# Altium project 28_Pins.PrjPcb (part 3 of 4)
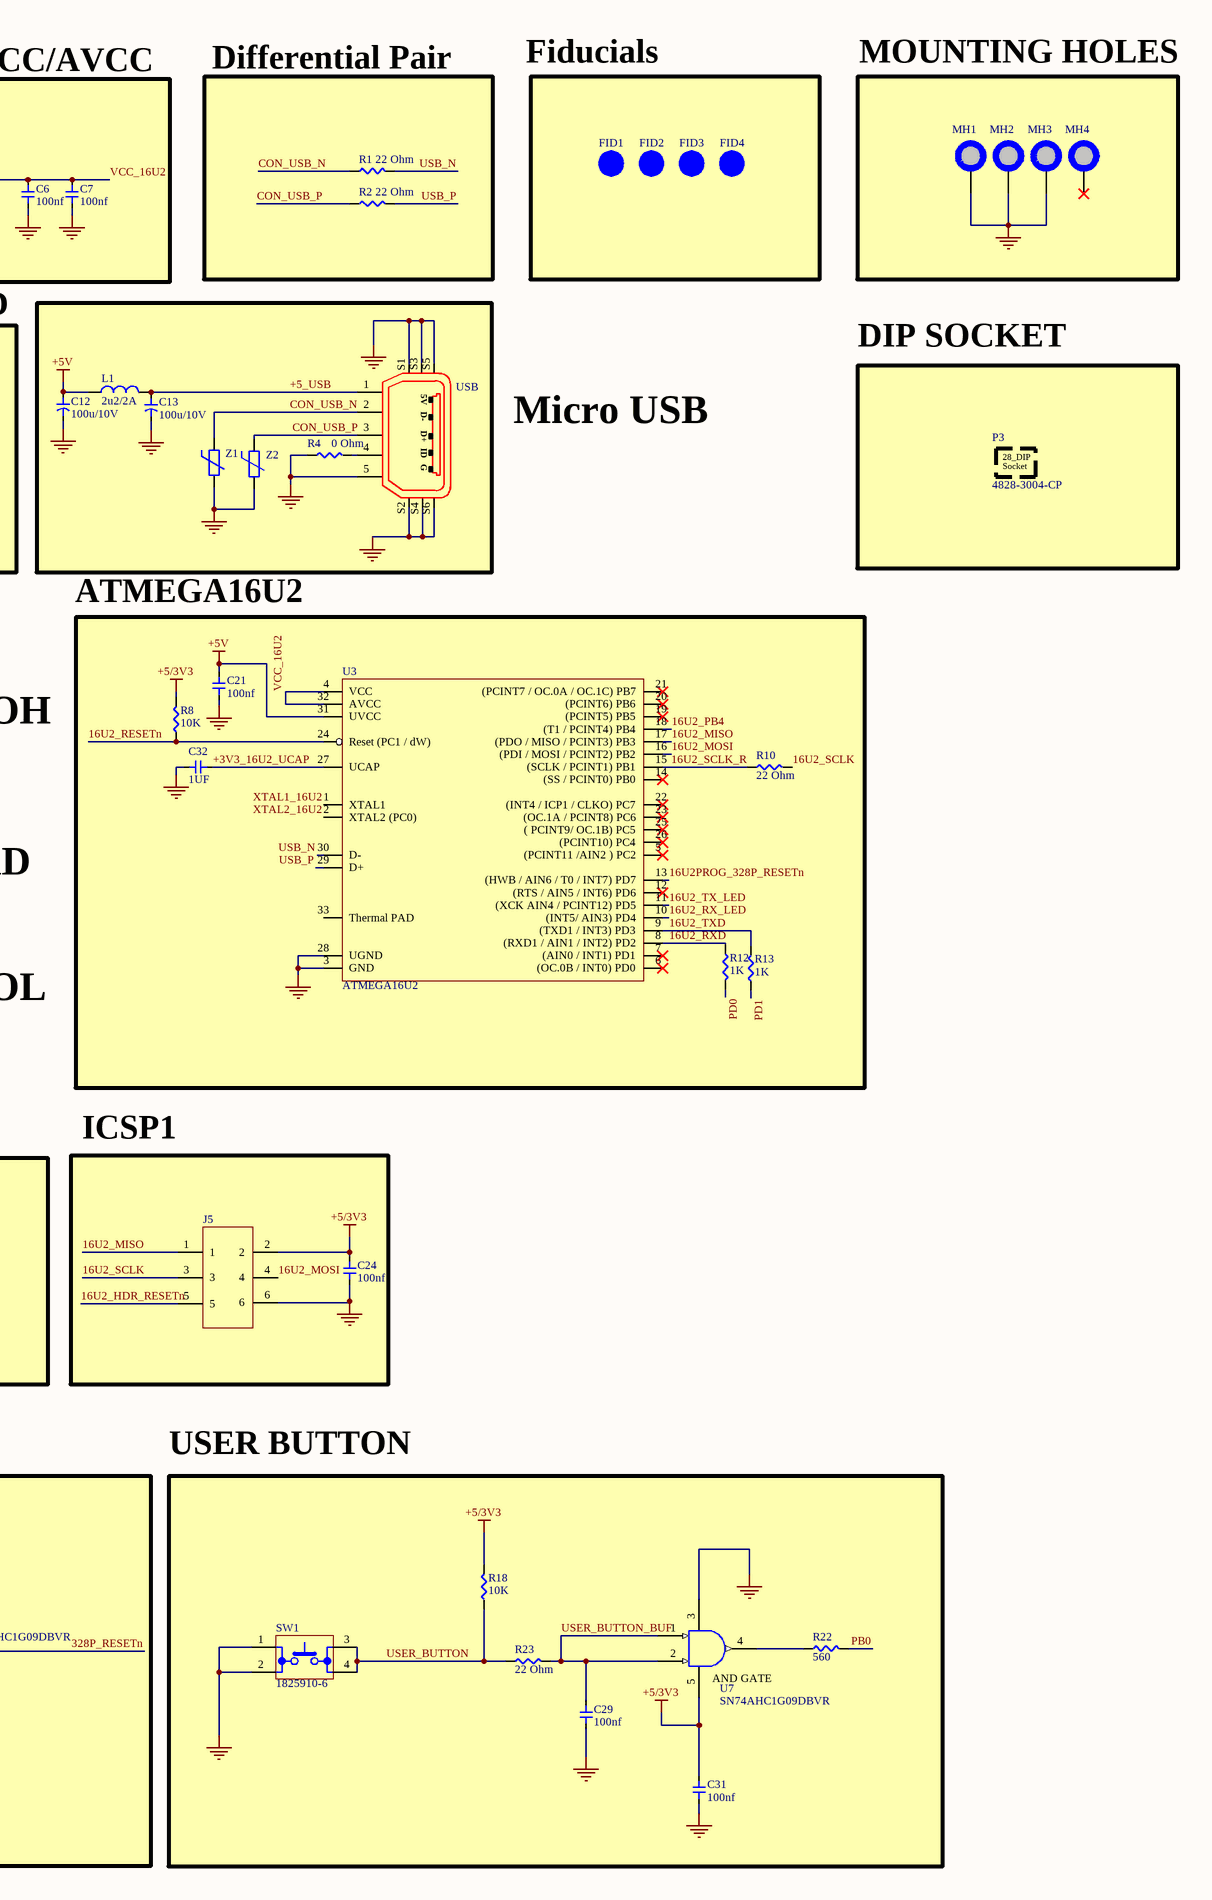
[diagram p3: 28_Pins.SchDoc, right]

## Sheet 28_Pins.SchDoc (continued)

### Library data of the parts (continued)
J5 J6 = 67997-106HLF: Conn; Rect; Header; Unshrouded; 6 Pos; 2.54mm Pitch; 2-Row; Thru-Hole; BergStik; Manufacturer: Amphenol Communications Solutions; Connector Type: Male Pin; Current Rating: 5A; Dielectric Material: Polyethylene; Gender: Male; Insulation Resistance: 5GΩ; Lead Length: 3.05mm; Mating Post Length: 5.84mm; Max Voltage Rating (AC): 1.5kV; Number of Contacts: 6; Supplier 1: DigiKey; Manufacturer Part Number: 67997-106HLF; RoHS: Compliant; Category: Headers and Wire Housings; Stock 1: 3917; Pricing 1: 1=0.58, 10=0.49, 400=0.37728, 800=0.35925, 1200=0.34911, 5200=0.31479, 10000=0.3006 (USD); China RoHS: Compliant; Color: Black; Contact Gender: Male; Contact Material: Bronze; Contact Mating Length: 5.842mm; Contact Plating: Gold; Depth: 4.83mm; Flammability Rating: UL94 V-0; Housing Color: Black; Housing Material: Thermoplastic; Lead Free: Lead Free; Lead Pitch: 2.54mm; Length: 7.62mm; Lifecycle Status: Production; Max Operating Temperature: 130°C; Min Operating Temperature: -65°C; Mount: Through Hole; Number of Pins: 6; Number of Positions: 6; Number of Rows: 2; Orientation: Straight; Pitch: 2.54mm; Radiation Hardening: No; REACH SVHC: Yes; Row Spacing: 2.54mm; Schedule B: 8535908040, 8535908040|8535908040|8535908040|8535908040|8535908040|8535908040|8535908040|8535908040|8535908040|8535908040|8535908040|8535908040|8535908040|8535908040|8535908040|8535908040|8535908040|8535908040|8535908040|8535908040|8535908040|8535908040|8535908040|85; Terminal Pitch: 2.54mm; Termination: Through Hole; Voltage Rating: 1.5kV; ComponentLink1URL: https://datasheet.octopart.com:443/67997-106HLF-Amphenol-Communications-Solutions-datasheet-10288749.pdf?src-supplier=Newark; ComponentLink1Description: https://datasheet.octopart.com:443/67997-106HLF-Amphenol-Communications-Solutions-datasheet-10288749.pdf?src-supplier=Newark; ComponentLink2URL: https://datasheet.octopart.com:443/67997-106HLF-Areva-datasheet-10052131.pdf?src-supplier=Newark; ComponentLink2Description: https://datasheet.octopart.com:443/67997-106HLF-Areva-datasheet-10052131.pdf?src-supplier=Newark; ComponentLink3URL: https://datasheet.octopart.com:443/67997-106HLF-Areva-datasheet-8877144.pdf?src-supplier=Newark; ComponentLink3Description: https://datasheet.octopart.com:443/67997-106HLF-Areva-datasheet-8877144.pdf?src-supplier=Newark; ComponentLink4URL: https://datasheet.octopart.com:443/67997-106HLF-Areva-datasheet-8731571.pdf?src-supplier=Newark; ComponentLink4Description: https://datasheet.octopart.com:443/67997-106HLF-Areva-datasheet-8731571.pdf?src-supplier=Newark; ComponentLink5URL: https://datasheet.octopart.com:443/67997-106HLF-Areva-datasheet-8486089.pdf?src-supplier=Newark; ComponentLink5Description: https://datasheet.octopart.com:443/67997-106HLF-Areva-datasheet-8486089.pdf?src-supplier=Newark; ComponentLink6URL: https://datasheet.octopart.com:443/67997-106HLF-Amphenol-Communications-Solutions-datasheet-36854132.pdf?src-supplier=Farnell; ComponentLink6Description: https://datasheet.octopart.com:443/67997-106HLF-Amphenol-Communications-Solutions-datasheet-36854132.pdf?src-supplier=Farnell; ComponentLink7URL: https://datasheet.octopart.com:443/67997-106HLF-Amphenol-Communications-Solutions-datasheet-20739478.pdf?src-supplier=RS+(Formerly+Allied+Electronics); ComponentLink7Description: https://datasheet.octopart.com:443/67997-106HLF-Amphenol-Communications-Solutions-datasheet-20739478.pdf?src-supplier=RS+(Formerly+Allied+Electronics); ComponentLink8URL: https://datasheet.octopart.com:443/67997-106HLF-Areva-datasheet-118652.pdf?src-supplier=DigiKey; ComponentLink8Description: https://datasheet.octopart.com:443/67997-106HLF-Areva-datasheet-118652.pdf?src-supplier=DigiKey; Supplier Part Number 1: 609-3393-ND
J7 J10 = 68000-103HLF: Pin Header, Board-to-Board, 2.54 mm, 1 Rows, 3 Contacts, Through Hole, FCI BergStik II 68000; Manufacturer: Amphenol Communications Solutions; Connector Type: Male Pin; Current Rating: 3A; Dielectric Material: Polyethylene; Gender: Male; Insulation Resistance: 5GΩ; Lead Length: 2.41mm; Mating Post Length: 5.84mm; Max Voltage Rating (AC): 1.5kV; Number of Contacts: 3; Pitch: 2.54mm; Plating Thickness: 762nm; Voltage Rating: 1.05kV; Supplier 1: Avnet; Manufacturer Part Number: 68000-103HLF; RoHS: Compliant; Category: Headers and Wire Housings; Stock 1: 9210; Pricing 1: 1=0.332, 2=0.298, 4=0.286, 8=0.264, 16=0.241, 32=0.238, 64=0.234 (USD); China RoHS: Compliant; Color: Black; Contact Gender: Male; Contact Material: Gold; Contact Mating Length: 5.842mm; Contact Plating: Gold; Depth: 2.41mm; Flammability Rating: UL94 V-0; Height: 8.73mm; Housing Color: Black; Housing Material: Thermoplastic; Lead Pitch: 2.54mm; Length: 7.62mm; Lifecycle Status: Production; Max Operating Temperature: 125°C; Min Operating Temperature: -65°C; Mount: Through Hole; Number of Pins: 3; Number of Positions: 3; Number of Rows: 1; Orientation: Straight; Packaging: Bulk; Radiation Hardening: No; REACH SVHC: Yes; Terminal Pitch: 2.54mm; Termination: Solder; ComponentLink1URL: https://datasheet.octopart.com:443/68000-103HLF-Amphenol-ICC---FCI-datasheet-155511504.pdf?src-supplier=Upverter; ComponentLink1Description: https://datasheet.octopart.com:443/68000-103HLF-Amphenol-ICC---FCI-datasheet-155511504.pdf?src-supplier=Upverter; ComponentLink2URL: https://datasheet.octopart.com:443/68000-103HLF-Amphenol-Communications-Solutions-datasheet-10088795.pdf?src-supplier=Farnell; ComponentLink2Description: https://datasheet.octopart.com:443/68000-103HLF-Amphenol-Communications-Solutions-datasheet-10088795.pdf?src-supplier=Farnell; ComponentLink3URL: https://datasheet.octopart.com:443/68000-103HLF-Amphenol-Communications-Solutions-datasheet-41232361.pdf?src-supplier=Farnell; ComponentLink3Description: https://datasheet.octopart.com:443/68000-103HLF-Amphenol-Communications-Solutions-datasheet-41232361.pdf?src-supplier=Farnell; ComponentLink4URL: https://datasheet.octopart.com:443/68000-103HLF-Areva-datasheet-8861575.pdf?src-supplier=Newark; ComponentLink4Description: https://datasheet.octopart.com:443/68000-103HLF-Areva-datasheet-8861575.pdf?src-supplier=Newark; ComponentLink5URL: https://datasheet.octopart.com:443/68000-103HLF-Areva-datasheet-8713716.pdf?src-supplier=Newark; ComponentLink5Description: https://datasheet.octopart.com:443/68000-103HLF-Areva-datasheet-8713716.pdf?src-supplier=Newark; ComponentLink6URL: https://datasheet.octopart.com:443/68000-103HLF-Areva-datasheet-8449737.pdf?src-supplier=Newark; ComponentLink6Description: https://datasheet.octopart.com:443/68000-103HLF-Areva-datasheet-8449737.pdf?src-supplier=Newark; ComponentLink7URL: https://datasheet.octopart.com:443/68000-103HLF-Amphenol-Communications-Solutions-datasheet-154727322.pdf?src-supplier=Electro+Sonic; ComponentLink7Description: https://datasheet.octopart.com:443/68000-103HLF-Amphenol-Communications-Solutions-datasheet-154727322.pdf?src-supplier=Electro+Sonic; ComponentLink8URL: https://datasheet.octopart.com:443/68000-103HLF-Amphenol-Communications-Solutions-datasheet-100449246.pdf?src-supplier=TME; ComponentLink8Description: https://datasheet.octopart.com:443/68000-103HLF-Amphenol-Communications-Solutions-datasheet-100449246.pdf?src-supplier=TME; ComponentLink9URL: https://datasheet.octopart.com:443/68000-103HLF-Amphenol-datasheet-170317325.pdf?src-supplier=Amar+Radio+Corporation; ComponentLink9Description: https://datasheet.octopart.com:443/68000-103HLF-Amphenol-datasheet-170317325.pdf?src-supplier=Amar+Radio+Corporation; ComponentLink10URL: https://datasheet.octopart.com:443/68000-103HLF-Amphenol-Communications-Solutions-datasheet-13448982.pdf?src-supplier=RS+(Formerly+Allied+Electronics); ComponentLink10Description: https://datasheet.octopart.com:443/68000-103HLF-Amphenol-Communications-Solutions-datasheet-13448982.pdf?src-supplier=RS+(Formerly+Allied+Electronics); Supplier Part Number 1: 88K1775
J8 = 68001-204HLF: Conn Unshrouded Header HDR 4 POS 2.54mm Solder ST Top Entry Thru-Hole BergStik® Bulk; Manufacturer: Amphenol Communications Solutions; Connector Type: Male Pin; Current Rating: 3A; Gender: Male; Insulation Resistance: 5GΩ; Lead Length: 3.05mm; Mating Post Length: 5.84mm; Number of Contacts: 4; Voltage Rating: 1.5kV; Supplier 1: Avnet; Manufacturer Part Number: 68001-204HLF; RoHS: Compliant; Category: Headers and Wire Housings; Stock 1: 10500; Pricing 1: 1000=0.08941 (USD); China RoHS: Compliant; Color: Black; Contact Gender: Male; Contact Material: Bronze; Contact Mating Length: 5.842mm; Contact Plating: GXT, Gold; Flammability Rating: UL94 V-0; Housing Material: Thermoplastic; Lead Pitch: 2.54mm; Lifecycle Status: Production; Max Operating Temperature: 130°C; Min Operating Temperature: -65°C; Mount: Through Hole; Number of Pins: 4; Number of Positions: 4; Number of Rows: 1; Orientation: Straight; Packaging: Bulk; Pitch: 2.54mm; Radiation Hardening: No; REACH SVHC: Yes; Schedule B: 8535908040; Terminal Pitch: 2.54mm; Termination: Solder; ComponentLink1URL: https://datasheet.octopart.com:443/68001-204HLF-Amphenol-Communications-Solutions-datasheet-151206381.pdf?src-supplier=IHS; ComponentLink1Description: https://datasheet.octopart.com:443/68001-204HLF-Amphenol-Communications-Solutions-datasheet-151206381.pdf?src-supplier=IHS; ComponentLink2URL: https://datasheet.octopart.com:443/68001-204HLF-Amphenol-Communications-Solutions-datasheet-154727322.pdf?src-supplier=Master+Electronics; ComponentLink2Description: https://datasheet.octopart.com:443/68001-204HLF-Amphenol-Communications-Solutions-datasheet-154727322.pdf?src-supplier=Master+Electronics; ComponentLink3URL: https://datasheet.octopart.com:443/68001-204HLF-Amphenol-Communications-Solutions-datasheet-41232361.pdf?src-supplier=element14+APAC; ComponentLink3Description: https://datasheet.octopart.com:443/68001-204HLF-Amphenol-Communications-Solutions-datasheet-41232361.pdf?src-supplier=element14+APAC; ComponentLink4URL: https://datasheet.octopart.com:443/68001-204HLF-Amphenol-Communications-Solutions-datasheet-100449246.pdf?src-supplier=Future+Electronics; ComponentLink4Description: https://datasheet.octopart.com:443/68001-204HLF-Amphenol-Communications-Solutions-datasheet-100449246.pdf?src-supplier=Future+Electronics; ComponentLink5URL: https://datasheet.octopart.com:443/68001-204HLF-Amphenol-Communications-Solutions-datasheet-20739502.pdf?src-supplier=RS+(Formerly+Allied+Electronics); ComponentLink5Description: https://datasheet.octopart.com:443/68001-204HLF-Amphenol-Communications-Solutions-datasheet-20739502.pdf?src-supplier=RS+(Formerly+Allied+Electronics); Supplier Part Number 1: 68001-204HLF
L1 = L1210R2R2MDWIT: General Purpose Inductor, 2.2uH, 20%, 1 Element, Ferrite-Core, SMD, 1210; Manufacturer: KEMET; Current Rating: 2A; DC Current: 1.13A; DC Resistance (DCR): 80mΩ; Inductance: 2.2µH; Number of Circuits: 1; Self Resonant Frequency: 190MHz; Shielding: No; Test Frequency: 100kHz; Supplier 1: Farnell; Manufacturer Part Number: L1210R2R2MDWIT; RoHS: Compliant; Category: Fixed Inductors; Pricing 1: 10=0.271, 100=0.204, 500=0.189, 1000=0.173, 2000=0.17 (GBP); Case/Package: 1210; Case Code (Imperial): 1210; Case Code (Metric): 3225; Composition: Ceramic, Wirewound; Core Material: Ferrite; Depth: 2.7mm; Height: 2.5mm; Height - Seated (Max): 2.6924mm; Inductance Tolerance: 20%; Length: 3.2004mm; Lifecycle Status: Obsolete; Max Current Rating: 1.13A; Max DC Current: 2A; Max Operating Temperature: 105°C; Military Standard: Not; Min Operating Temperature: -25°C; Mount: Surface Mount; Number of Terminals: 2; Packaging: Cut Tape; Radiation Hardening: No; REACH SVHC: Yes; Resistance: 80mΩ; Schedule B: 8504500000, 8504500000|8504500000, 8504500000|8504500000|8504500000, 8504500000|8504500000|8504500000|8504500000; Termination: SMD/SMT; Tolerance: 20%; Width: 2.5mm; ComponentLink1URL: https://datasheet.octopart.com:443/L1210R2R2MDWIT-KEMET-datasheet-179859846.pdf?src-supplier=Farnell; ComponentLink1Description: https://datasheet.octopart.com:443/L1210R2R2MDWIT-KEMET-datasheet-179859846.pdf?src-supplier=Farnell; ComponentLink2URL: https://datasheet.octopart.com:443/L1210R2R2MDWIT-Kemet-datasheet-13696102.pdf?src-supplier=Farnell; ComponentLink2Description: https://datasheet.octopart.com:443/L1210R2R2MDWIT-Kemet-datasheet-13696102.pdf?src-supplier=Farnell; ComponentLink3URL: https://datasheet.octopart.com:443/L1210R2R2MDWIT-KEMET-datasheet-170164675.pdf?src-supplier=Newark; ComponentLink3Description: https://datasheet.octopart.com:443/L1210R2R2MDWIT-KEMET-datasheet-170164675.pdf?src-supplier=Newark; ComponentLink4URL: https://datasheet.octopart.com:443/L1210R2R2MDWIT-Kemet-datasheet-153804.pdf?src-supplier=element14+APAC; ComponentLink4Description: https://datasheet.octopart.com:443/L1210R2R2MDWIT-Kemet-datasheet-153804.pdf?src-supplier=element14+APAC; ComponentLink5URL: https://datasheet.octopart.com:443/L1210R2R2MDWIT-KEMET-datasheet-86778059.pdf?src-supplier=element14+APAC; ComponentLink5Description: https://datasheet.octopart.com:443/L1210R2R2MDWIT-KEMET-datasheet-86778059.pdf?src-supplier=element14+APAC; ComponentLink6URL: https://datasheet.octopart.com:443/L1210R2R2MDWIT-KEMET-datasheet-147336235.pdf?src-supplier=Ciiva; ComponentLink6Description: https://datasheet.octopart.com:443/L1210R2R2MDWIT-KEMET-datasheet-147336235.pdf?src-supplier=Ciiva; Supplier Part Number 1: 3638976
P3 = 4828-3004-CP: IC Socket, DIP28, 28 Contact(s), 2.54mm Term Pitch, 7.62mm Row Spacing, Solder; Manufacturer: 3M; Connector Type: DIP, Socket; Current Rating: 1A; Gender: Female; Insulation Resistance: 5GΩ; Number of Contacts: 28; Supplier 1: Avnet; Manufacturer Part Number: 4828-3004-CP; RoHS: Compliant; Category: Connectors; Stock 1: 1313; Pricing 1: 1=1.09, 10=0.958, 25=0.9, 50=0.863, 100=0.827, 250=0.754, 500=0.677 (USD); China RoHS: Compliant; Contact Material: Bronze; Contact Plating: Tin; Depth: 5.08mm; Housing Material: Glass; Lead Free: Lead Free; Length: 35.43mm; Lifecycle Status: Production; Max Operating Temperature: 85°C; Min Operating Temperature: -25°C; Mount: Through Hole; Number of Pins: 28; Number of Positions: 28; Number of Rows: 2; Orientation: Straight; Pitch: 2.54mm; REACH SVHC: Yes; Row Spacing: 7.62mm; Terminal Pitch: 2.54mm; Termination: Solder; Width: 10.16mm; ComponentLink1URL: https://datasheet.octopart.com:443/4828-3004-CP-3M-datasheet-11754339.pdf?src-supplier=element14+APAC; ComponentLink1Description: https://datasheet.octopart.com:443/4828-3004-CP-3M-datasheet-11754339.pdf?src-supplier=element14+APAC; ComponentLink2URL: https://datasheet.octopart.com:443/4828-3004-CP-3M-datasheet-125432.pdf?src-supplier=Verical; ComponentLink2Description: https://datasheet.octopart.com:443/4828-3004-CP-3M-datasheet-125432.pdf?src-supplier=Verical; ComponentLink3URL: https://datasheet.octopart.com:443/4828-3004-CP-3M-datasheet-110561487.pdf?src-supplier=RS+(Formerly+Allied+Electronics); ComponentLink3Description: https://datasheet.octopart.com:443/4828-3004-CP-3M-datasheet-110561487.pdf?src-supplier=RS+(Formerly+Allied+Electronics); ComponentLink4URL: https://datasheet.octopart.com:443/4828-3004-CP-3M-datasheet-12002015.pdf?src-supplier=RS+(Formerly+Allied+Electronics); ComponentLink4Description: https://datasheet.octopart.com:443/4828-3004-CP-3M-datasheet-12002015.pdf?src-supplier=RS+(Formerly+Allied+Electronics); ComponentLink5URL: http://sigma.octopart.com:80/conflict_mineral_statement/3M-company-24.pdf?src-supplier=Compliance+Statements; ComponentLink5Description: http://sigma.octopart.com:80/conflict_mineral_statement/3M-company-24.pdf?src-supplier=Compliance+Statements; Supplier Part Number 1: 34P8056
R1 R2 R7 R10 R21 R23 R24 = RC0805FR-0722RL: Res Thick Film 0805 22 Ohm 1% 0.125W(1/8W) ±100ppm/C Pad SMD T/R; Manufacturer: Yageo Group; Max Power Dissipation: 125mW; Resistance: 22Ω; Temperature Coefficient: 100ppm/°C; Voltage Rating: 150V; Supplier 1: Future Electronics; Manufacturer Part Number: RC0805FR-0722RL; RoHS: Compliant; Category: Chip SMD Resistors; Stock 1: 385000; Pricing 1: 5000=0.0018, 25000=0.0017, 125000=0.0016, 375000=0.0016, 1000000=0.0015 (USD); Case/Package: 0805; Case Code (Imperial): 0805; China RoHS: Non-Compliant; Composition: Thick Film; Depth: 1.25mm; Features: Moisture Resistant; Height: 500µm; Lead Free: Lead Free; Length: 2.0066mm; Lifecycle Status: Production; Max Operating Temperature: 155°C; Military Standard: Not; Min Operating Temperature: -55°C; Mount: Surface Mount; Number of Pins: 2; Number of Terminals: 2; Number of Terminations: 2; Packaging: Tape & Reel; Power Dissipation: 125mW; Power Rating: 125mW; REACH SVHC: Yes; Schedule B: 8533210045, 8533210045|8533210045, 8533210045|8533210045|8533210045, 8533210045|8533210045|8533210045|8533210045; Termination: SMD/SMT; Tolerance: 1%; Voltage Rating (AC): 150V; Voltage Rating (DC): 150V; Width: 1.25mm; Working Voltage: 150V; ComponentLink1URL: https://datasheet.octopart.com:443/RC0805FR-0722RL-Yageo-datasheet-175887523.pdf?src-supplier=IHS; ComponentLink1Description: https://datasheet.octopart.com:443/RC0805FR-0722RL-Yageo-datasheet-175887523.pdf?src-supplier=IHS; ComponentLink2URL: https://datasheet.octopart.com:443/RC0805FR-0722RL-Yageo-datasheet-103092701.pdf?src-supplier=Upverter; ComponentLink2Description: https://datasheet.octopart.com:443/RC0805FR-0722RL-Yageo-datasheet-103092701.pdf?src-supplier=Upverter; ComponentLink3URL: https://datasheet.octopart.com:443/RC0805FR-0722RL-Yageo-datasheet-79472498.pdf?src-supplier=Upverter; ComponentLink3Description: https://datasheet.octopart.com:443/RC0805FR-0722RL-Yageo-datasheet-79472498.pdf?src-supplier=Upverter; ComponentLink4URL: https://datasheet.octopart.com:443/RC0805FR-0722RL-Yageo-datasheet-8330313.pdf?src-supplier=element14+APAC; ComponentLink4Description: https://datasheet.octopart.com:443/RC0805FR-0722RL-Yageo-datasheet-8330313.pdf?src-supplier=element14+APAC; ComponentLink5URL: https://datasheet.octopart.com:443/RC0805FR-0722RL-Yageo-datasheet-62067350.pdf?src-supplier=element14+APAC; ComponentLink5Description: https://datasheet.octopart.com:443/RC0805FR-0722RL-Yageo-datasheet-62067350.pdf?src-supplier=element14+APAC; ComponentLink6URL: https://datasheet.octopart.com:443/RC0805FR-0722RL-Yageo-datasheet-164759695.pdf?src-supplier=Future+Electronics; ComponentLink6Description: https://datasheet.octopart.com:443/RC0805FR-0722RL-Yageo-datasheet-164759695.pdf?src-supplier=Future+Electronics; ComponentLink7URL: https://datasheet.octopart.com:443/RC0805FR-0722RL-Yageo-datasheet-12592811.pdf?src-supplier=Future+Electronics; ComponentLink7Description: https://datasheet.octopart.com:443/RC0805FR-0722RL-Yageo-datasheet-12592811.pdf?src-supplier=Future+Electronics; ComponentLink8URL: https://datasheet.octopart.com:443/RC0805FR-0722RL-Yageo-datasheet-8324252.pdf?src-supplier=Future+Electronics; ComponentLink8Description: https://datasheet.octopart.com:443/RC0805FR-0722RL-Yageo-datasheet-8324252.pdf?src-supplier=Future+Electronics; ComponentLink9URL: https://datasheet.octopart.com/RC0805FR-0722RL-Yageo-datasheet-73766026.pdf; ComponentLink9Description: https://datasheet.octopart.com/RC0805FR-0722RL-Yageo-datasheet-73766026.pdf; ComponentLink10URL: https://datasheet.octopart.com:443/RC0805FR-0722RL-Yageo-datasheet-13691069.pdf?src-supplier=Farnell; ComponentLink10Description: https://datasheet.octopart.com:443/RC0805FR-0722RL-Yageo-datasheet-13691069.pdf?src-supplier=Farnell; ComponentLink11URL: https://datasheet.octopart.com:443/RC0805FR-0722RL-Yageo-datasheet-118657.pdf?src-supplier=DigiKey; ComponentLink11Description: https://datasheet.octopart.com:443/RC0805FR-0722RL-Yageo-datasheet-118657.pdf?src-supplier=DigiKey; ComponentLink12URL: http://sigma.octopart.com:80/rohs_statement/Yageo-company-2.pdf?src-supplier=Compliance+Statements; ComponentLink12Description: http://sigma.octopart.com:80/rohs_statement/Yageo-company-2.pdf?src-supplier=Compliance+Statements; ComponentLink13URL: http://sigma.octopart.com:80/conflict_mineral_statement/Yageo-company-3.pdf?src-supplier=Compliance+Statements; ComponentLink13Description: http://sigma.octopart.com:80/conflict_mineral_statement/Yageo-company-3.pdf?src-supplier=Compliance+Statements; Supplier Part Number 1: 3012390
R3 R8 R9 R17-R20 = RC0805FR-0710KL: Res Thick Film 0805 10K Ohm 1% 0.125W(1/8W) +/-100ppm/C Epoxy Pad SMD T/R; Manufacturer: Yageo Group; Max Power Dissipation: 125mW; Resistance: 10kΩ; Temperature Coefficient: 100ppm/°C; Voltage Rating: 150V; Supplier 1: Future Electronics; Manufacturer Part Number: RC0805FR-0710KL; RoHS: Compliant; Category: Chip SMD Resistors; Stock 1: 5075000; Pricing 1: 5000=0.0018, 25000=0.0017, 125000=0.0016, 375000=0.0016, 1000000=0.0015 (USD); Case/Package: 0805; Case Code (Imperial): 0805; China RoHS: Non-Compliant; Composition: Thick Film; Depth: 1.25mm; Features: Moisture Resistant; Height: 500µm; Lead Free: Lead Free; Length: 2mm; Lifecycle Status: Production; Max Operating Temperature: 155°C; Military Standard: Not; Min Operating Temperature: -55°C; Mount: Surface Mount; Number of Pins: 2; Number of Terminals: 2; Number of Terminations: 2; Packaging: Tape and Reel; Power Dissipation: 125mW; Power Rating: 125mW; REACH SVHC: Yes; Schedule B: 8533210045, 8533210045|8533210045|8533210045|8533210045|8533210045|8533210045|8533210045|8533210045|8533210045|8533210045|8533210045|8533210045|8533210045|8533210045|8533210045|8533210045|8533210045|8533210045|8533210045|8533210045|8533210045|8533210045|8533210045|85; Termination: SMD/SMT; Tolerance: 1%; Voltage Rating (AC): 150V; Width: 1.25mm; Working Voltage: 150V; ComponentLink1URL: https://datasheet.octopart.com:443/RC0805FR-0710KL-Yageo-datasheet-175887523.pdf?src-supplier=IHS; ComponentLink1Description: https://datasheet.octopart.com:443/RC0805FR-0710KL-Yageo-datasheet-175887523.pdf?src-supplier=IHS; ComponentLink2URL: https://datasheet.octopart.com:443/RC0805FR-0710KL-Yageo-datasheet-62067350.pdf?src-supplier=Farnell; ComponentLink2Description: https://datasheet.octopart.com:443/RC0805FR-0710KL-Yageo-datasheet-62067350.pdf?src-supplier=Farnell; ComponentLink3URL: https://datasheet.octopart.com:443/RC0805FR-0710KL-Yageo-datasheet-13691069.pdf?src-supplier=Farnell; ComponentLink3Description: https://datasheet.octopart.com:443/RC0805FR-0710KL-Yageo-datasheet-13691069.pdf?src-supplier=Farnell; ComponentLink4URL: https://datasheet.octopart.com:443/RC0805FR-0710KL-Yageo-datasheet-103092701.pdf?src-supplier=Upverter; ComponentLink4Description: https://datasheet.octopart.com:443/RC0805FR-0710KL-Yageo-datasheet-103092701.pdf?src-supplier=Upverter; ComponentLink5URL: https://datasheet.octopart.com:443/RC0805FR-0710KL-Yageo-datasheet-98239111.pdf?src-supplier=Upverter; ComponentLink5Description: https://datasheet.octopart.com:443/RC0805FR-0710KL-Yageo-datasheet-98239111.pdf?src-supplier=Upverter; ComponentLink6URL: https://datasheet.octopart.com:443/RC0805FR-0710KL-Yageo---Phycomp-datasheet-67302840.pdf?src-supplier=Upverter; ComponentLink6Description: https://datasheet.octopart.com:443/RC0805FR-0710KL-Yageo---Phycomp-datasheet-67302840.pdf?src-supplier=Upverter; ComponentLink7URL: https://datasheet.octopart.com:443/RC0805FR-0710KL-Yageo-datasheet-8330313.pdf?src-supplier=element14+APAC; ComponentLink7Description: https://datasheet.octopart.com:443/RC0805FR-0710KL-Yageo-datasheet-8330313.pdf?src-supplier=element14+APAC; ComponentLink8URL: https://datasheet.octopart.com:443/RC0805FR-0710KL-Yageo-datasheet-12592811.pdf?src-supplier=element14+APAC; ComponentLink8Description: https://datasheet.octopart.com:443/RC0805FR-0710KL-Yageo-datasheet-12592811.pdf?src-supplier=element14+APAC; ComponentLink9URL: https://datasheet.octopart.com:443/RC0805FR-0710KL-Yageo-datasheet-164759695.pdf?src-supplier=Future+Electronics; ComponentLink9Description: https://datasheet.octopart.com:443/RC0805FR-0710KL-Yageo-datasheet-164759695.pdf?src-supplier=Future+Electronics; ComponentLink10URL: https://datasheet.octopart.com:443/RC0805FR-0710KL-Yageo-datasheet-15800360.pdf?src-supplier=Future+Electronics; ComponentLink10Description: https://datasheet.octopart.com:443/RC0805FR-0710KL-Yageo-datasheet-15800360.pdf?src-supplier=Future+Electronics; ComponentLink11URL: https://datasheet.octopart.com:443/RC0805FR-0710KL-Yageo-datasheet-8324252.pdf?src-supplier=Future+Electronics; ComponentLink11Description: https://datasheet.octopart.com:443/RC0805FR-0710KL-Yageo-datasheet-8324252.pdf?src-supplier=Future+Electronics; ComponentLink12URL: https://datasheet.octopart.com:443/RC0805FR-0710KL-Yageo-datasheet-79472498.pdf?src-supplier=Megastar; ComponentLink12Description: https://datasheet.octopart.com:443/RC0805FR-0710KL-Yageo-datasheet-79472498.pdf?src-supplier=Megastar; ComponentLink13URL: https://datasheet.octopart.com:443/RC0805FR-0710KL-Yageo-datasheet-27714392.pdf?src-supplier=Seeed+Studio; ComponentLink13Description: https://datasheet.octopart.com:443/RC0805FR-0710KL-Yageo-datasheet-27714392.pdf?src-supplier=Seeed+Studio; ComponentLink14URL: https://datasheet.octopart.com/RC0805FR-0710KL-Yageo-datasheet-73766026.pdf; ComponentLink14Description: https://datasheet.octopart.com/RC0805FR-0710KL-Yageo-datasheet-73766026.pdf; ComponentLink15URL: https://datasheet.octopart.com:443/RC0805FR-0710KL-Yageo-datasheet-118657.pdf?src-supplier=DigiKey; ComponentLink15Description: https://datasheet.octopart.com:443/RC0805FR-0710KL-Yageo-datasheet-118657.pdf?src-supplier=DigiKey; ComponentLink16URL: https://datasheet.octopart.com:443/RC0805FR-0710KL-Yageo-datasheet-502840.pdf?src-supplier=element14; ComponentLink16Description: https://datasheet.octopart.com:443/RC0805FR-0710KL-Yageo-datasheet-502840.pdf?src-supplier=element14; ComponentLink17URL: http://sigma.octopart.com:80/rohs_statement/Yageo-company-2.pdf?src-supplier=Compliance+Statements; ComponentLink17Description: http://sigma.octopart.com:80/rohs_statement/Yageo-company-2.pdf?src-supplier=Compliance+Statements; ComponentLink18URL: http://sigma.octopart.com:80/conflict_mineral_statement/Yageo-company-3.pdf?src-supplier=Compliance+Statements; ComponentLink18Description: http://sigma.octopart.com:80/conflict_mineral_statement/Yageo-company-3.pdf?src-supplier=Compliance+Statements; Supplier Part Number 1: 3310877
R4 = RC0805JR-070RL: GENERAL PURPOSE CHIP RESISTOR Metal Glaze/thick Film, 0.125W, 0ohm, Surface Mount, 0805; Manufacturer: Yageo Group; Power Dissipation: 125mW; Resistance: 0Ω; Temperature Coefficient: 300ppm/°C; Tolerance: 5%; Voltage Rating: 150V; Supplier 1: Future Electronics; Manufacturer Part Number: RC0805JR-070RL; RoHS: Compliant; Category: Chip SMD Resistors; Stock 1: 900000; Pricing 1: 5000=0.0015, 25000=0.0015, 125000=0.0014, 375000=0.0013, 1000000=0.0013 (USD); Case/Package: 0805; Case Code (Imperial): 0805; China RoHS: Non-Compliant; Composition: Thick Film; Contact Plating: Tin; Depth: 1.25mm; Height: 500µm; Lead Free: Lead Free; Length: 2mm; Lifecycle Status: Production; Max Operating Temperature: 155°C; Military Standard: Not; Min Operating Temperature: -55°C; Mount: Surface Mount; Number of Pins: 2; Number of Terminals: 2; Packaging: Tape & Reel; Power Rating: 125mW; Radiation Hardening: No; REACH SVHC: Yes; Schedule B: 8533290000, 8533290000|8533290000, 8533290000|8533290000|8533290000, 8533290000|8533290000|8533290000|8533290000; Termination: SMD/SMT; Voltage Rating (DC): 150V; Width: 1.25mm; ComponentLink1URL: https://datasheet.octopart.com:443/RC0805JR-070RL-Yageo-datasheet-182189538.pdf?src-supplier=IHS; ComponentLink1Description: https://datasheet.octopart.com:443/RC0805JR-070RL-Yageo-datasheet-182189538.pdf?src-supplier=IHS; ComponentLink2URL: https://datasheet.octopart.com:443/RC0805JR-070RL-Yageo-datasheet-103092701.pdf?src-supplier=Upverter; ComponentLink2Description: https://datasheet.octopart.com:443/RC0805JR-070RL-Yageo-datasheet-103092701.pdf?src-supplier=Upverter; ComponentLink3URL: https://datasheet.octopart.com:443/RC0805JR-070RL-Yageo-datasheet-98239111.pdf?src-supplier=Upverter; ComponentLink3Description: https://datasheet.octopart.com:443/RC0805JR-070RL-Yageo-datasheet-98239111.pdf?src-supplier=Upverter; ComponentLink4URL: https://datasheet.octopart.com:443/RC0805JR-070RL-Yageo-datasheet-8330313.pdf?src-supplier=Newark; ComponentLink4Description: https://datasheet.octopart.com:443/RC0805JR-070RL-Yageo-datasheet-8330313.pdf?src-supplier=Newark; ComponentLink5URL: https://datasheet.octopart.com:443/RC0805JR-070RL-Yageo-datasheet-8327506.pdf?src-supplier=Newark; ComponentLink5Description: https://datasheet.octopart.com:443/RC0805JR-070RL-Yageo-datasheet-8327506.pdf?src-supplier=Newark; ComponentLink6URL: https://datasheet.octopart.com:443/RC0805JR-070RL-Yageo-datasheet-62067350.pdf?src-supplier=element14+APAC; ComponentLink6Description: https://datasheet.octopart.com:443/RC0805JR-070RL-Yageo-datasheet-62067350.pdf?src-supplier=element14+APAC; ComponentLink7URL: https://datasheet.octopart.com:443/RC0805JR-070RL-Yageo-datasheet-17879891.pdf?src-supplier=element14+APAC; ComponentLink7Description: https://datasheet.octopart.com:443/RC0805JR-070RL-Yageo-datasheet-17879891.pdf?src-supplier=element14+APAC; ComponentLink8URL: https://datasheet.octopart.com:443/RC0805JR-070RL-Yageo-datasheet-164759695.pdf?src-supplier=Future+Electronics; ComponentLink8Description: https://datasheet.octopart.com:443/RC0805JR-070RL-Yageo-datasheet-164759695.pdf?src-supplier=Future+Electronics; ComponentLink9URL: https://datasheet.octopart.com:443/RC0805JR-070RL-Yageo-datasheet-15800360.pdf?src-supplier=Future+Electronics; ComponentLink9Description: https://datasheet.octopart.com:443/RC0805JR-070RL-Yageo-datasheet-15800360.pdf?src-supplier=Future+Electronics; ComponentLink10URL: https://datasheet.octopart.com:443/RC0805JR-070RL-Yageo-datasheet-12592811.pdf?src-supplier=Future+Electronics; ComponentLink10Description: https://datasheet.octopart.com:443/RC0805JR-070RL-Yageo-datasheet-12592811.pdf?src-supplier=Future+Electronics; ComponentLink11URL: https://datasheet.octopart.com:443/RC0805JR-070RL-Yageo-datasheet-8324252.pdf?src-supplier=Future+Electronics; ComponentLink11Description: https://datasheet.octopart.com:443/RC0805JR-070RL-Yageo-datasheet-8324252.pdf?src-supplier=Future+Electronics; ComponentLink12URL: https://datasheet.octopart.com:443/RC0805JR-070RL-Yageo-datasheet-79472498.pdf?src-supplier=Megastar; ComponentLink12Description: https://datasheet.octopart.com:443/RC0805JR-070RL-Yageo-datasheet-79472498.pdf?src-supplier=Megastar; ComponentLink13URL: https://datasheet.octopart.com/RC0805JR-070RL-Yageo-datasheet-73766026.pdf; ComponentLink13Description: https://datasheet.octopart.com/RC0805JR-070RL-Yageo-datasheet-73766026.pdf; ComponentLink14URL: https://datasheet.octopart.com:443/RC0805JR-070RL-Yageo-datasheet-8377918.pdf?src-supplier=Farnell; ComponentLink14Description: https://datasheet.octopart.com:443/RC0805JR-070RL-Yageo-datasheet-8377918.pdf?src-supplier=Farnell; ComponentLink15URL: https://datasheet.octopart.com:443/RC0805JR-070RL-Yageo-datasheet-118657.pdf?src-supplier=DigiKey; ComponentLink15Description: https://datasheet.octopart.com:443/RC0805JR-070RL-Yageo-datasheet-118657.pdf?src-supplier=DigiKey; ComponentLink16URL: http://sigma.octopart.com:80/rohs_statement/Yageo-company-2.pdf?src-supplier=Compliance+Statements; ComponentLink16Description: http://sigma.octopart.com:80/rohs_statement/Yageo-company-2.pdf?src-supplier=Compliance+Statements; ComponentLink17URL: http://sigma.octopart.com:80/conflict_mineral_statement/Yageo-company-3.pdf?src-supplier=Compliance+Statements; ComponentLink17Description: http://sigma.octopart.com:80/conflict_mineral_statement/Yageo-company-3.pdf?src-supplier=Compliance+Statements; Supplier Part Number 1: 2506467
R5 R6 = RC0805FR-071ML: 125Mw Thick Film Resistors 100Ppm/ 1% 1M 0805 Chip Resistor Surface Mount Rohs; Manufacturer: Yageo Group; Resistance: 1MΩ; Temperature Coefficient: 100ppm/°C; Voltage Rating: 150V; Supplier 1: Avnet; Manufacturer Part Number: RC0805FR-071ML; RoHS: Compliant; Category: Chip SMD Resistors; Stock 1: 95000; Pricing 1: 5000=0.00245, 10000=0.00244, 20000=0.00243, 40000=0.00241, 80000=0.0024 (USD); Case/Package: 0805; Case Code (Imperial): 0805; China RoHS: Non-Compliant; Composition: Thick Film; Depth: 1.25mm; Features: Moisture Resistant; Height: 500µm; Lead Free: Lead Free; Length: 2mm; Lifecycle Status: Production; Max Operating Temperature: 155°C; Max Power Dissipation: 125mW; Military Standard: Not; Min Operating Temperature: -55°C; Mount: Surface Mount; Number of Pins: 2; Number of Terminals: 2; Number of Terminations: 2; Packaging: Tape & Reel; Power Dissipation: 125mW; Power Rating: 125mW; REACH SVHC: Yes; Schedule B: 8533210045, 8533210045|8533210045, 8533210045|8533210045|8533210045, 8533210045|8533210045|8533210045|8533210045; Termination: SMD/SMT; Tolerance: 1%; Voltage Rating (AC): 150V; Voltage Rating (DC): 150V; Width: 1.25mm; Working Voltage: 150V; ComponentLink1URL: https://datasheet.octopart.com:443/RC0805FR-071ML-Yageo-datasheet-175887523.pdf?src-supplier=IHS; ComponentLink1Description: https://datasheet.octopart.com:443/RC0805FR-071ML-Yageo-datasheet-175887523.pdf?src-supplier=IHS; ComponentLink2URL: https://datasheet.octopart.com:443/RC0805FR-071ML-Yageo-datasheet-103092701.pdf?src-supplier=Upverter; ComponentLink2Description: https://datasheet.octopart.com:443/RC0805FR-071ML-Yageo-datasheet-103092701.pdf?src-supplier=Upverter; ComponentLink3URL: https://datasheet.octopart.com:443/RC0805FR-071ML-Yageo-datasheet-79472498.pdf?src-supplier=Upverter; ComponentLink3Description: https://datasheet.octopart.com:443/RC0805FR-071ML-Yageo-datasheet-79472498.pdf?src-supplier=Upverter; ComponentLink4URL: https://datasheet.octopart.com:443/RC0805FR-071ML-Yageo-datasheet-8330313.pdf?src-supplier=element14+APAC; ComponentLink4Description: https://datasheet.octopart.com:443/RC0805FR-071ML-Yageo-datasheet-8330313.pdf?src-supplier=element14+APAC; ComponentLink5URL: https://datasheet.octopart.com:443/RC0805FR-071ML-Yageo-datasheet-62067350.pdf?src-supplier=Farnell; ComponentLink5Description: https://datasheet.octopart.com:443/RC0805FR-071ML-Yageo-datasheet-62067350.pdf?src-supplier=Farnell; ComponentLink6URL: https://datasheet.octopart.com:443/RC0805FR-071ML-Yageo-datasheet-13691069.pdf?src-supplier=Farnell; ComponentLink6Description: https://datasheet.octopart.com:443/RC0805FR-071ML-Yageo-datasheet-13691069.pdf?src-supplier=Farnell; ComponentLink7URL: https://datasheet.octopart.com:443/RC0805FR-071ML-Yageo-datasheet-164759695.pdf?src-supplier=Future+Electronics; ComponentLink7Description: https://datasheet.octopart.com:443/RC0805FR-071ML-Yageo-datasheet-164759695.pdf?src-supplier=Future+Electronics; ComponentLink8URL: https://datasheet.octopart.com:443/RC0805FR-071ML-Yageo-datasheet-127823281.pdf?src-supplier=Future+Electronics; ComponentLink8Description: https://datasheet.octopart.com:443/RC0805FR-071ML-Yageo-datasheet-127823281.pdf?src-supplier=Future+Electronics; ComponentLink9URL: https://datasheet.octopart.com:443/RC0805FR-071ML-Yageo-datasheet-137700087.pdf?src-supplier=Future+Electronics; ComponentLink9Description: https://datasheet.octopart.com:443/RC0805FR-071ML-Yageo-datasheet-137700087.pdf?src-supplier=Future+Electronics; ComponentLink10URL: https://datasheet.octopart.com:443/RC0805FR-071ML-Yageo-datasheet-12592811.pdf?src-supplier=Future+Electronics; ComponentLink10Description: https://datasheet.octopart.com:443/RC0805FR-071ML-Yageo-datasheet-12592811.pdf?src-supplier=Future+Electronics; ComponentLink11URL: https://datasheet.octopart.com:443/RC0805FR-071ML-Yageo-datasheet-8324252.pdf?src-supplier=Future+Electronics; ComponentLink11Description: https://datasheet.octopart.com:443/RC0805FR-071ML-Yageo-datasheet-8324252.pdf?src-supplier=Future+Electronics; ComponentLink12URL: https://datasheet.octopart.com/RC0805FR-071ML-Yageo-datasheet-73766026.pdf; ComponentLink12Description: https://datasheet.octopart.com/RC0805FR-071ML-Yageo-datasheet-73766026.pdf; ComponentLink13URL: https://datasheet.octopart.com:443/RC0805FR-071ML-Yageo-datasheet-118657.pdf?src-supplier=DigiKey; ComponentLink13Description: https://datasheet.octopart.com:443/RC0805FR-071ML-Yageo-datasheet-118657.pdf?src-supplier=DigiKey; ComponentLink14URL: https://datasheet.octopart.com:443/RC0805FR-071ML-Yageo-datasheet-502840.pdf?src-supplier=element14; ComponentLink14Description: https://datasheet.octopart.com:443/RC0805FR-071ML-Yageo-datasheet-502840.pdf?src-supplier=element14; ComponentLink15URL: http://sigma.octopart.com:80/rohs_statement/Yageo-company-2.pdf?src-supplier=Compliance+Statements; ComponentLink15Description: http://sigma.octopart.com:80/rohs_statement/Yageo-company-2.pdf?src-supplier=Compliance+Statements; ComponentLink16URL: http://sigma.octopart.com:80/conflict_mineral_statement/Yageo-company-3.pdf?src-supplier=Compliance+Statements; ComponentLink16Description: http://sigma.octopart.com:80/conflict_mineral_statement/Yageo-company-3.pdf?src-supplier=Compliance+Statements; Supplier Part Number 1: RC0805FR-071ML
R11 R14 R22 = RC0805FR-07560RL: Res Thick Film 0805 560 Ohm 1% 0.125W(1/8W) ±100ppm/C Pad SMD T/R; Manufacturer: Yageo Group; Max Power Dissipation: 125mW; Resistance: 560Ω; Temperature Coefficient: 100ppm/°C; Voltage Rating: 150V; Supplier 1: Future Electronics; Manufacturer Part Number: RC0805FR-07560RL; RoHS: Compliant; Category: Chip SMD Resistors; Stock 1: 90000; Pricing 1: 5000=0.0018, 25000=0.0017, 125000=0.0016, 375000=0.0016, 1000000=0.0015 (USD); Case/Package: 0805; Case Code (Imperial): 0805; China RoHS: Non-Compliant; Composition: Thick Film; Depth: 1.25mm; Features: Moisture Resistant; Height: 500µm; Lead Free: Lead Free; Length: 2mm; Lifecycle Status: Production; Max Operating Temperature: 155°C; Military Standard: Not; Min Operating Temperature: -55°C; Mount: Surface Mount; Number of Pins: 2; Number of Terminals: 2; Number of Terminations: 2; Packaging: Tape & Reel; Power Dissipation: 125mW; Power Rating: 125mW; REACH SVHC: Yes; Schedule B: 8533210045, 8533210045|8533210045, 8533210045|8533210045|8533210045, 8533210045|8533210045|8533210045|8533210045; Termination: SMD/SMT; Tolerance: 1%; Voltage Rating (AC): 150V; Voltage Rating (DC): 150V; Weight: 5.499807mg; Width: 1.25mm; Working Voltage: 150V; ComponentLink1URL: https://datasheet.octopart.com:443/RC0805FR-07560RL-Yageo-datasheet-175887523.pdf?src-supplier=Newark; ComponentLink1Description: https://datasheet.octopart.com:443/RC0805FR-07560RL-Yageo-datasheet-175887523.pdf?src-supplier=Newark; ComponentLink2URL: https://datasheet.octopart.com:443/RC0805FR-07560RL-Yageo-datasheet-8328172.pdf?src-supplier=Newark; ComponentLink2Description: https://datasheet.octopart.com:443/RC0805FR-07560RL-Yageo-datasheet-8328172.pdf?src-supplier=Newark; ComponentLink3URL: https://datasheet.octopart.com:443/RC0805FR-07560RL-Yageo-datasheet-103092701.pdf?src-supplier=Upverter; ComponentLink3Description: https://datasheet.octopart.com:443/RC0805FR-07560RL-Yageo-datasheet-103092701.pdf?src-supplier=Upverter; ComponentLink4URL: https://datasheet.octopart.com:443/RC0805FR-07560RL-Yageo-datasheet-8330313.pdf?src-supplier=element14+APAC; ComponentLink4Description: https://datasheet.octopart.com:443/RC0805FR-07560RL-Yageo-datasheet-8330313.pdf?src-supplier=element14+APAC; ComponentLink5URL: https://datasheet.octopart.com:443/RC0805FR-07560RL-Yageo-datasheet-62067350.pdf?src-supplier=element14+APAC; ComponentLink5Description: https://datasheet.octopart.com:443/RC0805FR-07560RL-Yageo-datasheet-62067350.pdf?src-supplier=element14+APAC; ComponentLink6URL: https://datasheet.octopart.com:443/RC0805FR-07560RL-Yageo-datasheet-164759695.pdf?src-supplier=Future+Electronics; ComponentLink6Description: https://datasheet.octopart.com:443/RC0805FR-07560RL-Yageo-datasheet-164759695.pdf?src-supplier=Future+Electronics; ComponentLink7URL: https://datasheet.octopart.com:443/RC0805FR-07560RL-Yageo-datasheet-12592811.pdf?src-supplier=Future+Electronics; ComponentLink7Description: https://datasheet.octopart.com:443/RC0805FR-07560RL-Yageo-datasheet-12592811.pdf?src-supplier=Future+Electronics; ComponentLink8URL: https://datasheet.octopart.com:443/RC0805FR-07560RL-Yageo-datasheet-8324252.pdf?src-supplier=Future+Electronics; ComponentLink8Description: https://datasheet.octopart.com:443/RC0805FR-07560RL-Yageo-datasheet-8324252.pdf?src-supplier=Future+Electronics; ComponentLink9URL: https://datasheet.octopart.com:443/RC0805FR-07560RL-Yageo-datasheet-79472498.pdf?src-supplier=Megastar; ComponentLink9Description: https://datasheet.octopart.com:443/RC0805FR-07560RL-Yageo-datasheet-79472498.pdf?src-supplier=Megastar; ComponentLink10URL: https://datasheet.octopart.com/RC0805FR-07560RL-Yageo-datasheet-73766026.pdf; ComponentLink10Description: https://datasheet.octopart.com/RC0805FR-07560RL-Yageo-datasheet-73766026.pdf; ComponentLink11URL: https://datasheet.octopart.com:443/RC0805FR-07560RL-Yageo-datasheet-118657.pdf?src-supplier=DigiKey; ComponentLink11Description: https://datasheet.octopart.com:443/RC0805FR-07560RL-Yageo-datasheet-118657.pdf?src-supplier=DigiKey; ComponentLink12URL: http://sigma.octopart.com:80/rohs_statement/Yageo-company-2.pdf?src-supplier=Compliance+Statements; ComponentLink12Description: http://sigma.octopart.com:80/rohs_statement/Yageo-company-2.pdf?src-supplier=Compliance+Statements; ComponentLink13URL: http://sigma.octopart.com:80/conflict_mineral_statement/Yageo-company-3.pdf?src-supplier=Compliance+Statements; ComponentLink13Description: http://sigma.octopart.com:80/conflict_mineral_statement/Yageo-company-3.pdf?src-supplier=Compliance+Statements; Supplier Part Number 1: 2521029
R12 R13 R16 = RC0805FR-071KL: 125Mw Thick Film Resistors 100Ppm/ 1% 1K 0805 Chip Resistor Surface Mount Rohs; Manufacturer: Yageo Group; Resistance: 1kΩ; Temperature Coefficient: 100ppm/°C; Voltage Rating: 150V; Supplier 1: Future Electronics; Manufacturer Part Number: RC0805FR-071KL; RoHS: Compliant; Category: Chip SMD Resistors; Stock 1: 4230000; Pricing 1: 5000=0.0018, 25000=0.0017, 125000=0.0016, 375000=0.0016, 1000000=0.0015 (USD); Case/Package: 0805; Case Code (Imperial): 0805; China RoHS: Non-Compliant; Composition: Thick Film; Depth: 1.25mm; Features: Moisture Resistant; Height: 500µm; Lead Free: Lead Free; Length: 2mm; Lifecycle Status: Production; Max Operating Temperature: 155°C; Max Power Dissipation: 125mW; Military Standard: Not; Min Operating Temperature: -55°C; Mount: Surface Mount; Number of Pins: 2; Number of Terminals: 2; Number of Terminations: 2; Packaging: Tape & Reel; Power Dissipation: 125mW; Power Rating: 125mW; REACH SVHC: Yes; Schedule B: 8533210045, 8533210045|8533210045, 8533210045|8533210045|8533210045, 8533210045|8533210045|8533210045|8533210045; Termination: SMD/SMT; Tolerance: 1%; Voltage Rating (AC): 150V; Voltage Rating (DC): 150V; Width: 1.25mm; Working Voltage: 150V; ComponentLink1URL: https://datasheet.octopart.com:443/RC0805FR-071KL-Yageo-datasheet-175887523.pdf?src-supplier=IHS; ComponentLink1Description: https://datasheet.octopart.com:443/RC0805FR-071KL-Yageo-datasheet-175887523.pdf?src-supplier=IHS; ComponentLink2URL: https://datasheet.octopart.com:443/RC0805FR-071KL-Yageo-datasheet-103092701.pdf?src-supplier=Upverter; ComponentLink2Description: https://datasheet.octopart.com:443/RC0805FR-071KL-Yageo-datasheet-103092701.pdf?src-supplier=Upverter; ComponentLink3URL: https://datasheet.octopart.com:443/RC0805FR-071KL-Yageo-datasheet-8330313.pdf?src-supplier=element14+APAC; ComponentLink3Description: https://datasheet.octopart.com:443/RC0805FR-071KL-Yageo-datasheet-8330313.pdf?src-supplier=element14+APAC; ComponentLink4URL: https://datasheet.octopart.com:443/RC0805FR-071KL-Yageo-datasheet-62067350.pdf?src-supplier=element14+APAC; ComponentLink4Description: https://datasheet.octopart.com:443/RC0805FR-071KL-Yageo-datasheet-62067350.pdf?src-supplier=element14+APAC; ComponentLink5URL: https://datasheet.octopart.com:443/RC0805FR-071KL-Yageo-datasheet-12592811.pdf?src-supplier=element14+APAC; ComponentLink5Description: https://datasheet.octopart.com:443/RC0805FR-071KL-Yageo-datasheet-12592811.pdf?src-supplier=element14+APAC; ComponentLink6URL: https://datasheet.octopart.com:443/RC0805FR-071KL-Yageo-datasheet-164759695.pdf?src-supplier=Future+Electronics; ComponentLink6Description: https://datasheet.octopart.com:443/RC0805FR-071KL-Yageo-datasheet-164759695.pdf?src-supplier=Future+Electronics; ComponentLink7URL: https://datasheet.octopart.com:443/RC0805FR-071KL-Yageo-datasheet-8324252.pdf?src-supplier=Future+Electronics; ComponentLink7Description: https://datasheet.octopart.com:443/RC0805FR-071KL-Yageo-datasheet-8324252.pdf?src-supplier=Future+Electronics; ComponentLink8URL: https://datasheet.octopart.com:443/RC0805FR-071KL-Yageo-datasheet-79472498.pdf?src-supplier=Megastar; ComponentLink8Description: https://datasheet.octopart.com:443/RC0805FR-071KL-Yageo-datasheet-79472498.pdf?src-supplier=Megastar; ComponentLink9URL: https://datasheet.octopart.com/RC0805FR-071KL-Yageo-datasheet-73766026.pdf; ComponentLink9Description: https://datasheet.octopart.com/RC0805FR-071KL-Yageo-datasheet-73766026.pdf; ComponentLink10URL: https://datasheet.octopart.com:443/RC0805FR-071KL-Yageo-datasheet-13691069.pdf?src-supplier=Farnell; ComponentLink10Description: https://datasheet.octopart.com:443/RC0805FR-071KL-Yageo-datasheet-13691069.pdf?src-supplier=Farnell; ComponentLink11URL: https://datasheet.octopart.com:443/RC0805FR-071KL-Yageo-datasheet-118657.pdf?src-supplier=DigiKey; ComponentLink11Description: https://datasheet.octopart.com:443/RC0805FR-071KL-Yageo-datasheet-118657.pdf?src-supplier=DigiKey; ComponentLink12URL: https://datasheet.octopart.com:443/RC0805FR-071KL-Yageo-datasheet-502840.pdf?src-supplier=element14; ComponentLink12Description: https://datasheet.octopart.com:443/RC0805FR-071KL-Yageo-datasheet-502840.pdf?src-supplier=element14; ComponentLink13URL: http://sigma.octopart.com:80/rohs_statement/Yageo-company-2.pdf?src-supplier=Compliance+Statements; ComponentLink13Description: http://sigma.octopart.com:80/rohs_statement/Yageo-company-2.pdf?src-supplier=Compliance+Statements; ComponentLink14URL: http://sigma.octopart.com:80/conflict_mineral_statement/Yageo-company-3.pdf?src-supplier=Compliance+Statements; ComponentLink14Description: http://sigma.octopart.com:80/conflict_mineral_statement/Yageo-company-3.pdf?src-supplier=Compliance+Statements; Supplier Part Number 1: 8126013